# EAGLE design audio_jack_breakout_SMD (EAGLE 6.4)
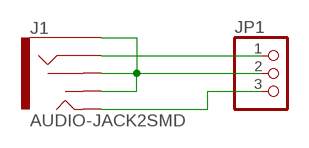
[diagram p0: schematic, sheet 1]

## Parts
J1  AUDIO-JACK2SMD  [AUDIO-JACK-3.5MM-SMD]
JP1  PINHD-1X3  [1X03]

## Nets
GND: J1.RSH J1.SLEEVE J1.TSH JP1.2
N$1: J1.RING JP1.1
N$2: J1.TIP JP1.3

## Library data of the parts
J1 = SparkFun-Connectors:AUDIO-JACK2: Stereo audio jack with bypass switches. Used on LilyPad MP3 board. Production SKU: CONN-10353; PROD_ID: CONN-10353
JP1 = pinhead:PINHD-1X3: PIN HEADER

## Board
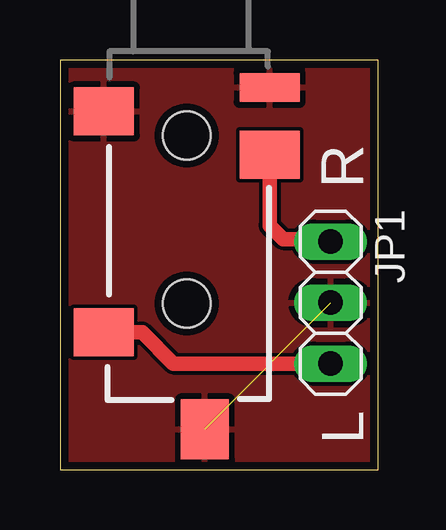
[diagram p1: board, top side]
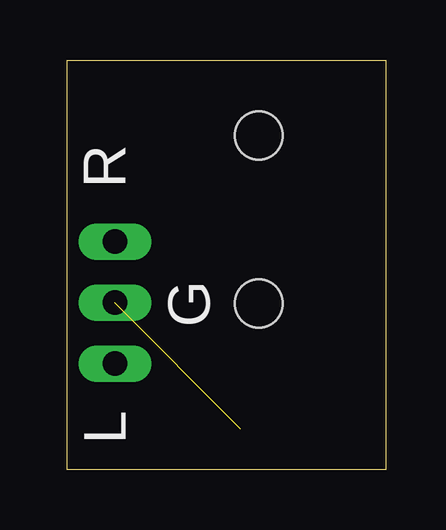
[diagram p2: board, bottom side, seen from below]

Size 13.26 x 17.07 mm. Coordinates in mm from the lower left corner, seen from the top.
Outline: 0,0 13.26,0 13.26,17.07 0,17.07 0,0
Copper layers (1*16): Top 0.035mm / dielectric 1.5mm / Bottom 0.035mm
Design rules "default *": minimum track width 6mil, minimum drill 13mil, track to track 6mil, track to pad 6mil, pad to pad 6mil, via to via 6mil, smd to smd 6mil, copper to edge 13mil, drill to drill 6mil, minimum pad ring 7mil, minimum via ring 7mil, stop-mask expansion 4mil, vias tented up to drill 0mil, thermal gap 10mil

### Footprints (pad centres in the part's own frame; a part is rotated, then mirrored left to right if it is on the bottom)
AUDIO-JACK-3.5MM-SMD = smd 2 x 2.5: RING 4.3,3.45; SLEEVE 2.5,-3.45; TIP 11.7,-3.45 | smd 1.2 x 2.5: RSH 1.5,3.45 | smd 2.5 x 2: TSH 15.75,0.75 | hole 2: 3.5,0; 10.5,0
1X03 = drill 1.016 long: 1 -2.54,0; 2 0,0; 3 2.54,0

### Placement (x,y rotation side)
J1  5.28,17.42 270 top
JP1  11.28,6.96 270 top

### Tracks (layer width: path | path; a pad name or v marks a point on that pad's centre or on a via)
GND  (1 unrouted)
  pour Top: 0.3,16.76 12.95,16.76 12.95,0.3 0.3,0.3
N$1
  Top 0.61: J1.RING 8.73,10.16 9.3,9.6 11.18,9.6 JP1.1
N$2
  Top 0.61: J1.TIP 3.42,5.72 4.72,4.42 JP1.3

### Text on the board
tPlace: R | L
bPlace: R | G | L